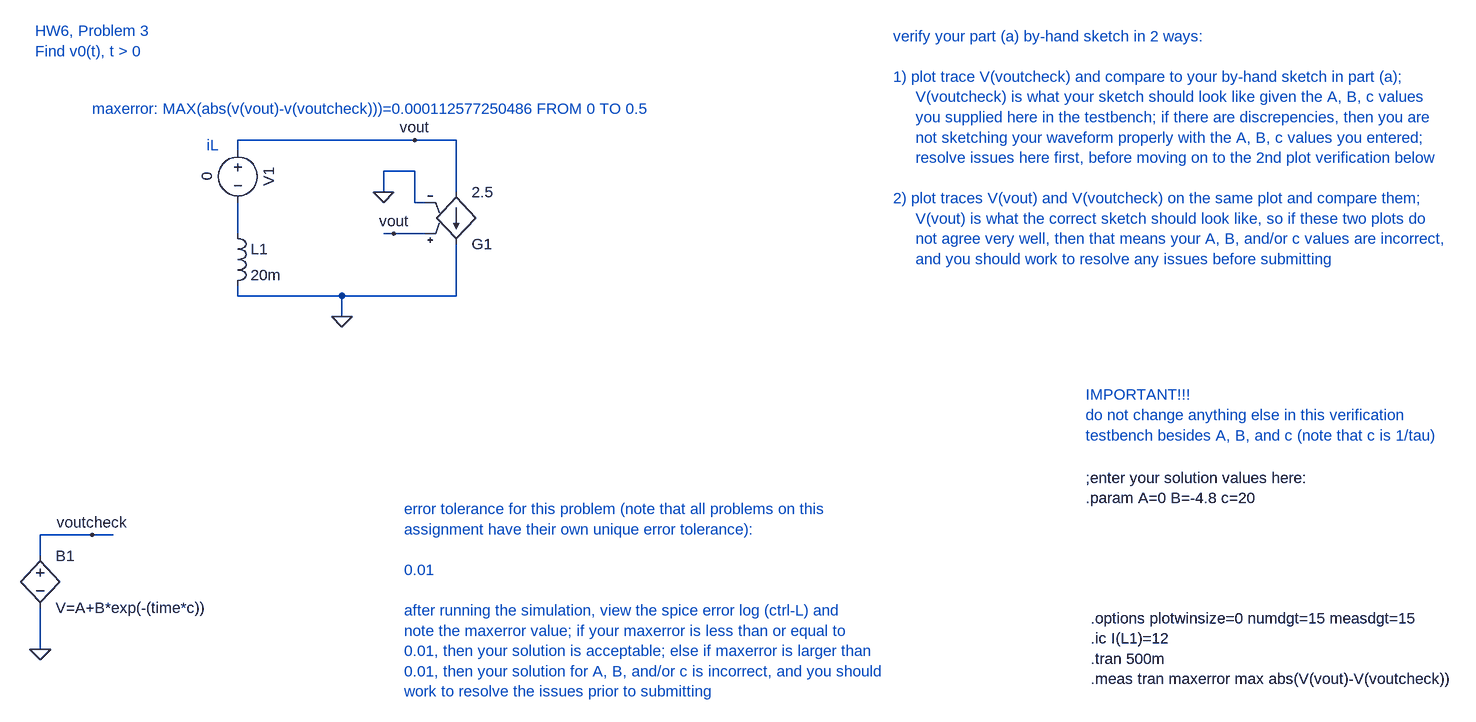
[diagram p0: schematic hw6_prob3.asc]
hw6_prob3.asc, the LTspice schematic file:
Version 4
SHEET 1 1792 1180
WIRE -160 -208 -432 -208
WIRE -96 -208 -160 -208
WIRE -432 -192 -432 -208
WIRE -160 -160 -208 -160
WIRE -208 -128 -208 -160
WIRE -96 -128 -96 -208
WIRE -160 -112 -160 -160
WIRE -144 -112 -160 -112
WIRE -432 -64 -432 -112
WIRE -192 -64 -208 -64
WIRE -144 -64 -192 -64
WIRE -432 32 -432 16
WIRE -272 32 -432 32
WIRE -96 32 -96 -48
WIRE -96 32 -272 32
WIRE -272 64 -272 32
WIRE -656 400 -736 400
WIRE -624 400 -656 400
WIRE -736 432 -736 400
WIRE -736 576 -736 512
FLAG -272 64 0
FLAG -208 -128 0
FLAG -160 -208 vout
FLAG -192 -64 vout
FLAG -736 576 0
FLAG -656 400 voutcheck
SYMBOL ind -448 -80 R0
SYMATTR SpiceLine Rser=0
SYMATTR InstName L1
SYMATTR Value 20m
SYMBOL voltage -432 -208 R0
WINDOW 0 32 56 VTop 2
WINDOW 3 -32 56 VBottom 2
WINDOW 123 0 0 Left 0
WINDOW 39 0 0 Left 0
SYMATTR InstName V1
SYMATTR Value 0
SYMBOL g -96 -32 M180
SYMATTR InstName G1
SYMATTR Value 2.5
SYMBOL bv -736 416 R0
SYMATTR InstName B1
SYMATTR Value V=A+B*exp(-(time*c))
TEXT 880 528 Left 2 !.options plotwinsize=0 numdgt=15 measdgt=15\n.ic I(L1)=12\n.tran 500m\n.meas tran maxerror max abs(V(vout)-V(voutcheck))
TEXT -744 -376 Left 2 ;HW6, Problem 3\nFind v0(t), t > 0
TEXT -480 -200 Left 2 ;iL
TEXT -176 360 Left 2 ;error tolerance for this problem (note that all problems on this \nassignment have their own unique error tolerance):\n \n0.01\n \nafter running the simulation, view the spice error log (ctrl-L) and \nnote the maxerror value; if your maxerror is less than or equal to\n0.01, then your solution is acceptable; else if maxerror is larger than\n0.01, then your solution for A, B, and/or c is incorrect, and you should \nwork to resolve the issues prior to submitting
TEXT 872 312 Left 2 !;enter your solution values here:\n.param A=0 B=-4.8 c=20
TEXT 872 184 Left 2 ;IMPORTANT!!!\ndo not change anything else in this verification\ntestbench besides A, B, and c (note that c is 1/tau)
TEXT 576 -368 Left 2 ;verify your part (a) by-hand sketch in 2 ways:\n \n1) plot trace V(voutcheck) and compare to your by-hand sketch in part (a);\n     V(voutcheck) is what your sketch should look like given the A, B, c values \n     you supplied here in the testbench; if there are discrepencies, then you are\n     not sketching your waveform properly with the A, B, c values you entered;\n     resolve issues here first, before moving on to the 2nd plot verification below\n \n2) plot traces V(vout) and V(voutcheck) on the same plot and compare them;\n     V(vout) is what the correct sketch should look like, so if these two plots do \n     not agree very well, then that means your A, B, and/or c values are incorrect,\n     and you should work to resolve any issues before submitting
TEXT -656 -256 Left 2 ;maxerror: MAX(abs(v(vout)-v(voutcheck)))=0.000112577250486 FROM 0 TO 0.5

The netlist it stands for:
* hw6_prob3.asc
L1 N001 0 20m Rser=0
V1 vout N001 0
G1 vout 0 vout 0 2.5
B1 voutcheck 0 V=A+B*exp(-(time*c))
.options plotwinsize=0 numdgt=15 measdgt=15
.ic I(L1)=12
.tran 500m
.meas tran maxerror max abs(V(vout)-V(voutcheck))
* HW6, Problem 3
* Find v0(t), t > 0
* iL
* error tolerance for this problem (note that all problems on this
* assignment have their own unique error tolerance):
* 0.01
* after running the simulation, view the spice error log (ctrl-L) and
* note the maxerror value; if your maxerror is less than or equal to
* 0.01, then your solution is acceptable; else if maxerror is larger than
* 0.01, then your solution for A, B, and/or c is incorrect, and you should
* work to resolve the issues prior to submitting
;enter your solution values here:
.param A=0 B=-4.8 c=20
* IMPORTANT!!!
* do not change anything else in this verification
* testbench besides A, B, and c (note that c is 1/tau)
* verify your part (a) by-hand sketch in 2 ways:
* 1) plot trace V(voutcheck) and compare to your by-hand sketch in part (a);
*      V(voutcheck) is what your sketch should look like given the A, B, c values
*      you supplied here in the testbench; if there are discrepencies, then you are
*      not sketching your waveform properly with the A, B, c values you entered;
*      resolve issues here first, before moving on to the 2nd plot verification below
* 2) plot traces V(vout) and V(voutcheck) on the same plot and compare them;
*      V(vout) is what the correct sketch should look like, so if these two plots do
*      not agree very well, then that means your A, B, and/or c values are incorrect,
*      and you should work to resolve any issues before submitting
* maxerror: MAX(abs(v(vout)-v(voutcheck)))=0.000112577250486 FROM 0 TO 0.5
.backanno
.end

* Results of the author's LTspice run, read from the files saved beside the schematic
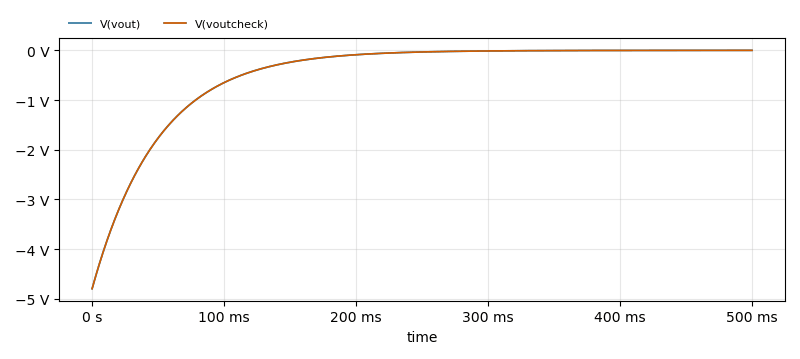
[diagram p1: Transient Analysis of hw6_prob3.asc, plotted from the saved traces]
* Transient Analysis, 1 run:
*   V(vout): min -4.8 V, max -217.9 µV, average -480 mV, rms 1.073 V, last -217.9 µV
*   V(voutcheck): min -4.8 V, max -217.9 µV, average -480 mV, rms 1.073 V, last -217.9 µV
* From the log:
*   maxerror: MAX(abs(v(vout)-v(voutcheck)))=0.000112577250486 FROM 0 TO 0.5